# EAGLE design schematic (EAGLE 9.2.0)
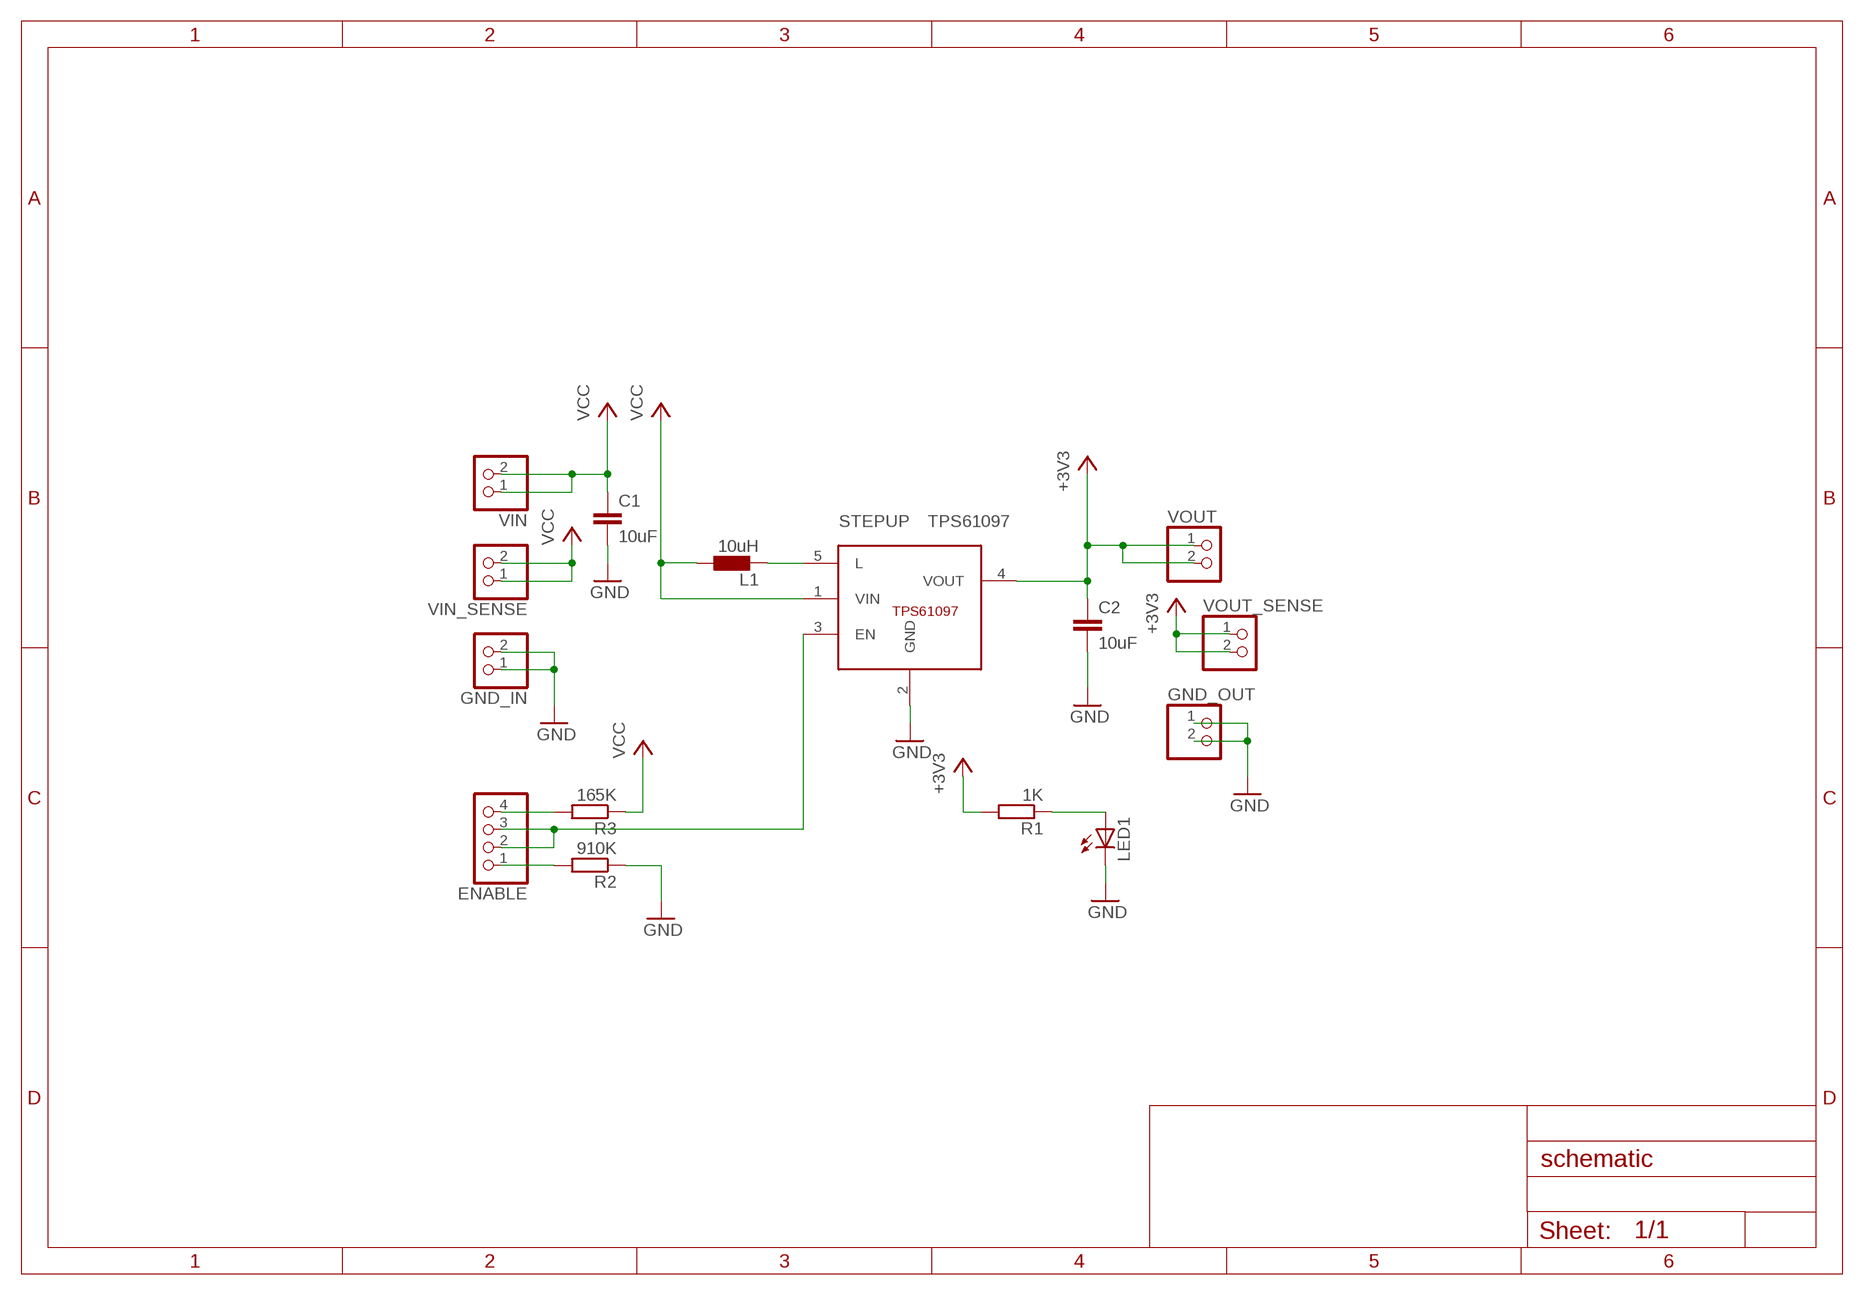
[diagram p0: schematic, sheet 1]

## Parts
C1  10uF  C-EUC1206  [C1206]
C2  10uF  C-EUC1206  [C1206]
ENABLE  PINHD-1X4  [1X04]
GND_IN  PINHD-1X2  [1X02]
GND_OUT  PINHD-1X2  [1X02]
L1  10uH  LL4532P  [L4532P]
LED1  LEDCHIP-LED0805  [CHIP-LED0805]
R1  1K  R-EU_R0805  [R0805]
R2  910K  R-EU_R0805  [R0805]
R3  165K  R-EU_R0805  [R0805]
STEPUP  TPS61097  [SOT-23]
VIN  PINHD-1X2  [1X02]
VIN_SENSE  PINHD-1X2  [1X02]
VOUT  PINHD-1X2  [1X02]
VOUT_SENSE  PINHD-1X2  [1X02]

## Nets
+3V3: C2.1 R1.2 STEPUP.4(VOUT) VOUT.1 VOUT.2 VOUT_SENSE.1 VOUT_SENSE.2
GND: C1.2 C2.2 GND_IN.1 GND_IN.2 GND_OUT.1 GND_OUT.2 LED1.C R2.1 STEPUP.2(GND)
N$1: LED1.A R1.1
N$2: L1.2 STEPUP.5(L)
N$4: ENABLE.2 ENABLE.3 STEPUP.3(EN)
N$5: ENABLE.1 R2.2
N$6: ENABLE.4 R3.2
VCC: C1.1 L1.1 R3.1 STEPUP.1(VIN) VIN.1 VIN.2 VIN_SENSE.1 VIN_SENSE.2

## Library data of the parts
C1 C2 = rcl:C-EU: CAPACITOR, European symbol; SPICEPREFIX: C
ENABLE = pinhead:PINHD-1X4: PIN HEADER
GND_IN GND_OUT VIN VIN_SENSE VOUT VOUT_SENSE = pinhead:PINHD-1X2: PIN HEADER
L1 = eagle-ltspice:L: INDUCTOR, European symbol; SPICEMODEL: NONE; SPICEPREFIX: L
LED1 = led:LED: LED OSRAM: - CHIPLED LG R971, LG N971, LY N971, LG Q971, LY Q971, LO R971, LY R971 LH N974, LH R974 LS Q976, LO Q976, LY Q976 LO Q996 - Hyper CHIPLED LW Q18S LB Q993, LB Q99A, LB R99A - SideLED LS A670, LO A670, LY A670, LG A670, LP A670 LB A673, LV A673, LT A673, LW A673 LH A674 LY A675 LS A676, LA A676, LO A676, LY A676, LW A676 LS A679, LY A679, LG A679 - Hyper Micro SIDELED® LS Y876, LA Y876, LO Y876, LY Y876 LT Y87S - SmartLED LW L88C, LW L88S LB L89C, LB L89S, LG L890 LS L89K, LO L89K, LY L89K LS L896, LA L896, LO L896, LY L896 - TOPLED LS T670, LO T670, LY T670, LG T670, LP T670 LSG T670, LSP T670, LSY T670, LOP T670, LYG T670 LG T671, LOG T671, LSG T671 LB T673, LV T673, LT T673, LW T673 LH T674 LS T676, LA T676, LO T676, LY T676, LB T676, LH T676, LSB T676, LW T676 LB T67C, LV T67C, LT T67C, LS T67K, LO T67K, LY T67K, LW E67C LS E67B, LA E67B, LO E67B, LY E67B, LB E67C, LV E67C, LT E67C LW T67C LS T679, LY T679, LG T679 LS T770, LO T770, LY T770, LG T770, LP T770 LB T773, LV T773, LT T773, LW T773 LH T774 LS E675, LA E675, LY E675, LS T675 LS T776, LA T776, LO T776, LY T776, LB T776 LHGB T686 LT T68C, LB T68C - Hyper Mini TOPLED® LB M676 - Mini TOPLED Santana® LG M470 LS M47K, LO M47K, LY M47K Source: http://www.osram.convergy.de LUXEON: - LUMILED® LXK2-PW12-R00, LXK2-PW12-S00, LXK2-PW14-U00, LXK2-PW14-V00 LXK2-PM12-R00, LXK2-PM12-S00, LXK2-PM14-U00 LXK2-PE12-Q00, LXK2-PE12-R00, LXK2-PE12-S00, LXK2-PE14-T00, LXK2-PE14-U00 LXK2-PB12-K00, LXK2-PB12-L00, LXK2-PB12-M00, LXK2-PB14-N00, LXK2-PB14-P00, LXK2-PB14-Q00 LXK2-PR12-L00, LXK2-PR12-M00, LXK2-PR14-Q00, LXK2-PR14-R00 LXK2-PD12-Q00, LXK2-PD12-R00, LXK2-PD12-S00 LXK2-PH12-R00, LXK2-PH12-S00 LXK2-PL12-P00, LXK2-PL12-Q00, LXK2-PL12-R00 Source: www.luxeon.com KINGBRIGHT: KA-3528ASYC Source: www.kingbright.com
R1-R3 = rcl:R-EU_: RESISTOR, European symbol; SPICEPREFIX: R
STEPUP = TPS61097-Lib:TPS61097: TPS61097 LOW INPUT VOLTAGE SYNCHRONOUS BOOST CONVERTER WITH LOW QUIESCENT CURRENT

## Board
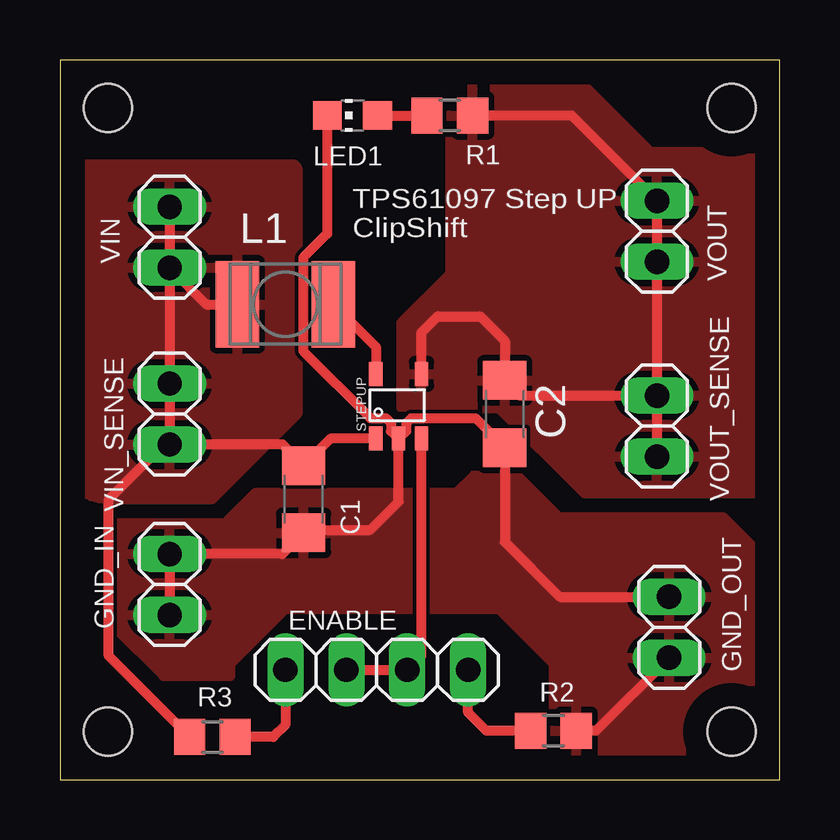
[diagram p1: board, top side]
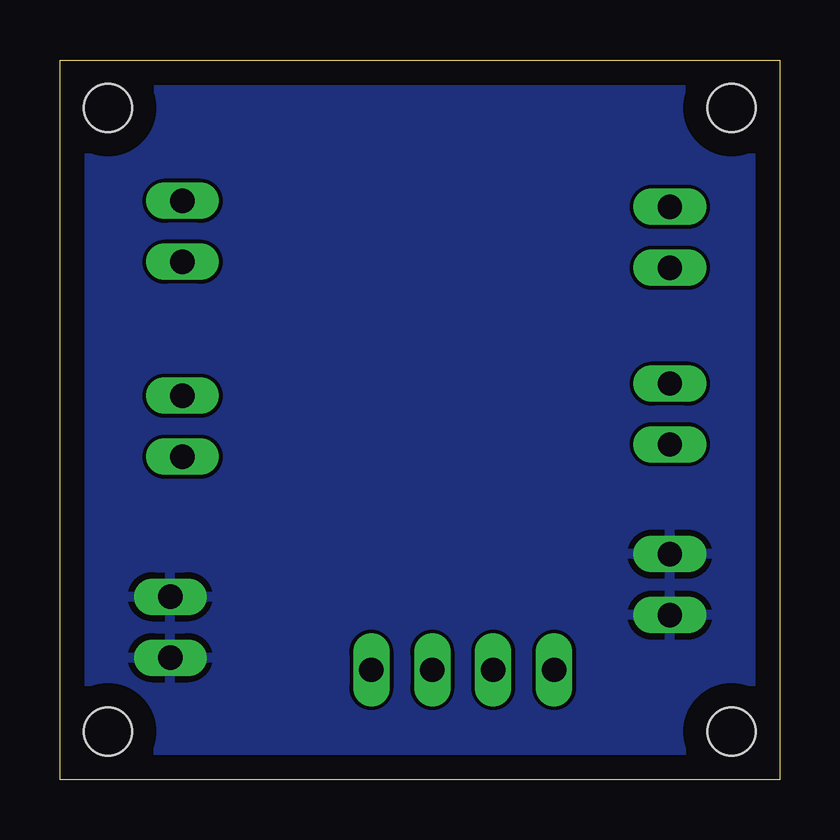
[diagram p2: board, bottom side, seen from below]

Size 30 x 30 mm. Coordinates in mm from the lower left corner, seen from the top.
Outline: 0,0 30,0 30,30 0,30 0,0
Copper layers (1*16): Top 0.035mm / dielectric 1.5mm / Bottom 0.035mm
Design rules "default": minimum track width 6mil, minimum drill 0.35mm, track to track 6mil, track to pad 6mil, pad to pad 6mil, via to via 6mil, smd to smd 6mil, copper to edge 40mil, drill to drill 6mil, minimum pad ring 10mil, minimum via ring 8mil, stop-mask expansion 4mil, vias tented up to drill 0mil, thermal gap 10mil
Holes 2 mm at 28,2 2,2 2,28 28,28

### Footprints (pad centres in the part's own frame; a part is rotated, then mirrored left to right if it is on the bottom)
C1206 = smd 1.6 x 1.8: 1 -1.4,0; 2 1.4,0
1X04 = drill 1.016 long: 1 -3.81,0; 2 -1.27,0; 3 1.27,0; 4 3.81,0
1X02 = drill 1.016 long: 1 -1.27,0; 2 1.27,0
L4532P = smd 1.8 x 3.6: 1 -2,0; 2 2,0
CHIP-LED0805 = smd 1.2 x 1.2: A 0,-1.05; C 0,1.05
R0805 = smd 1.3 x 1.5: 1 -0.95,0; 2 0.95,0
SOT-23 = smd 0.55 x 1: 1 0,0; 2 0.95,0; 3 1.9,0; 4 1.9,2.7; 5 0,2.7

### Placement (x,y rotation side)
C1  10.16,11.68 270 top
C2  18.54,15.24 270 top
ENABLE  13.21,4.57 180 top
GND_IN  4.57,8.13 90 top
GND_OUT  25.4,6.35 90 top
L1  9.4,19.81 0 top
LED1  12.19,27.69 90 top
R1  16.26,27.69 0 top
R2  20.57,2.03 180 top
R3  6.35,1.78 0 top
STEPUP  13.17,14.21 0 top
VIN  4.57,22.61 90 top
VIN_SENSE  4.57,15.24 270 top
VOUT  24.89,22.86 270 top
VOUT_SENSE  24.89,14.73 90 top

### Tracks (layer width: path | path; a pad name or v marks a point on that pad's centre or on a via)
+3V3
  Top 0.406: STEPUP.4 15.07,18.63 15.75,19.3 17.53,19.3 18.54,18.29 C2.1 19.18,16 VOUT_SENSE.2 | VOUT_SENSE.2 VOUT_SENSE.1 | VOUT_SENSE.2 VOUT.2 VOUT.1 21.34,27.69 R1.2
  pour Top: 29.97,26.16 24.64,26.16 20.83,29.97 16.51,29.97 16.26,29.72 16.26,21.08 14.22,19.05 14.22,15.49 18.29,15.49 21.84,11.94 29.72,11.94 29.97,12.19 29.97,25.91
GND
  Top 0.406: GND_OUT.2 20.83,7.62 18.54,9.91 C2.2 17.32,15.07 14.65,15.07 14.44,14.86 14.44,14.53 STEPUP.2 | GND_OUT.1 22.35,2.03 R2.1 | STEPUP.2 14.12,11.58 12.95,10.41 10.29,10.41 C1.2 9.27,9.4 GND_IN.2 GND_IN.1 | STEPUP.2 13.8,14.53 13.8,14.86 13.59,15.07 12.94,15.07 10.14,17.86 10.14,21.76 11.14,22.76 LED1.C
  pour Top: 2.29,10.67 2.29,6.35 4.32,4.32 7.11,4.32 7.11,4.83 9.4,7.11 18.29,7.11 20.57,4.83 20.57,0 29.72,0 29.97,0.25 29.97,8.64 27.69,10.92 20.83,10.92 19.05,12.7 17.27,12.7 16.51,11.94 8.13,11.94 6.86,10.67
  pour Bottom: 0,29.97 29.97,29.97 29.97,0 0,0
N$1
  Top 0.406: LED1.A R1.1
N$2
  Top 0.406: L1.2 13.17,18.04 STEPUP.5
N$4
  Top 0.406: ENABLE.3 ENABLE.2 15.07,5.16 STEPUP.3
N$5
  Top 0.406: R2.2 17.78,2.03 17.02,2.79 ENABLE.1
N$6
  Top 0.406: ENABLE.4 9.4,2.29 8.89,1.78 R3.2
VCC
  Top 0.406: VIN.1 6.1,19.81 L1.1 | VIN.2 VIN.1 | VIN.1 VIN_SENSE.1 VIN_SENSE.2 | STEPUP.1 11.29,14.21 C1.1 9.27,13.97 VIN_SENSE.2 | R3.1 2.03,5.15 2.03,11.68 4.32,13.97 VIN_SENSE.2
  pour Top: 0.25,25.65 9.65,25.65 arc-90 9.91,25.4 9.91,15.24 6.35,11.68 2.03,11.68 arc-90 0,13.72 0,25.65

### Text on the board
tNames: TPS61097 Step UP / ClipShift